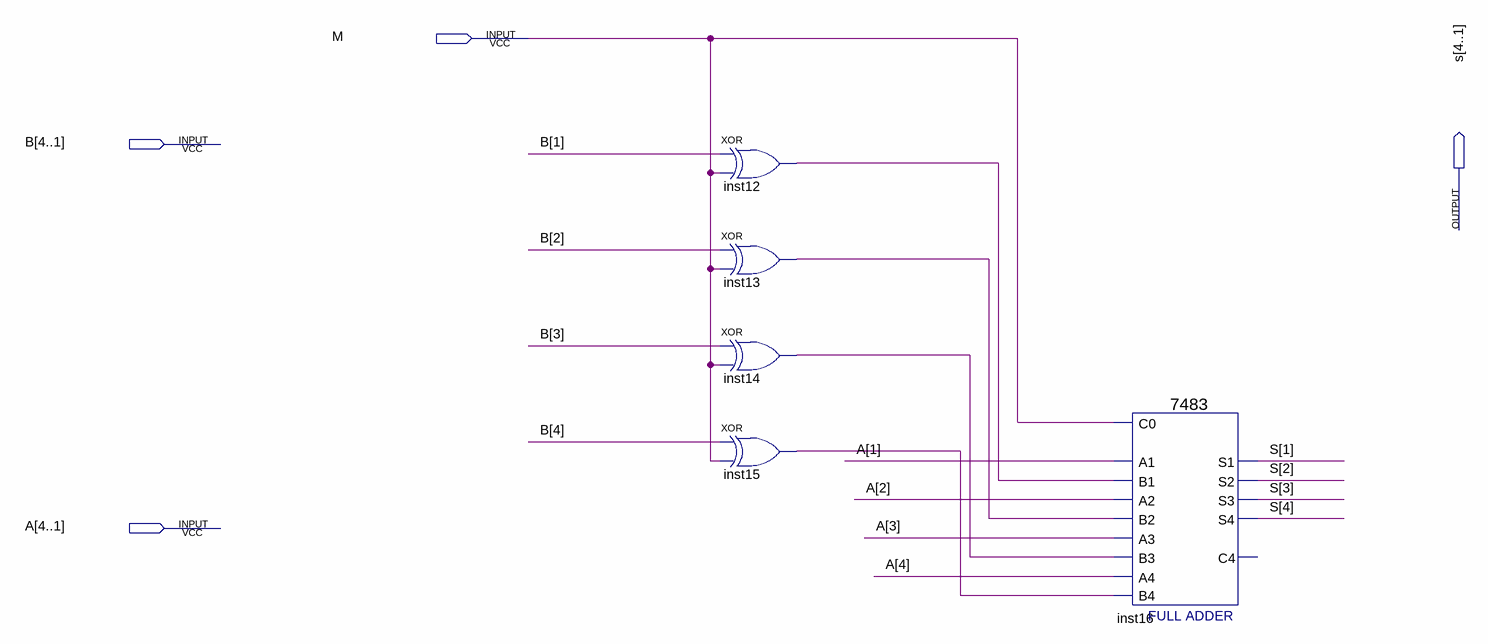
[diagram p0: schematic sheet]
// Quartus schematic Athristis.bdf as structural Verilog: 5 symbols, 4 pins
module Athristis (
  input  M,
  input  [4:1] B,
  input  [4:1] A,
  output [4:1] s
);

  wire inst12_out, inst13_out, inst14_out, inst15_out;

  xor inst12 (inst12_out, B[1], M);
  xor inst13 (inst13_out, B[2], M);
  xor inst14 (inst14_out, B[3], M);
  xor inst15 (inst15_out, B[4], M);
  \7483  inst16 (
    .B4(inst15_out), .C0(M), .A1(A[1]), .A2(A[2]), .B1(inst12_out), .B2(inst13_out), .A3(A[3]),
    .B3(inst14_out), .A4(A[4]), .S3(s[3]), .S4(s[4]), .S2(s[2]), .S1(s[1]));  // open: C4
endmodule
